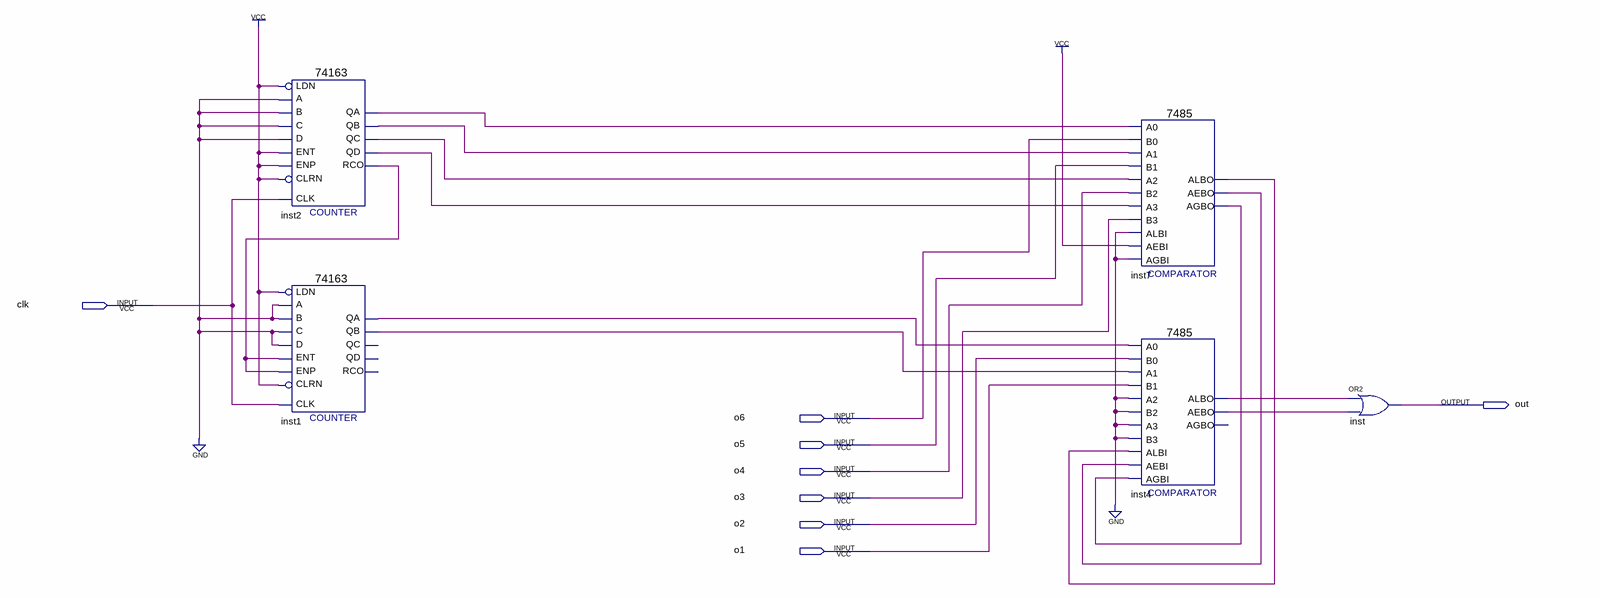
[diagram p0: schematic sheet]
// Quartus schematic Lab7part3.bdf as structural Verilog: 5 symbols, 8 pins
module Lab7part3 (
  input  clk,
  input  o6,
  input  o5,
  input  o4,
  input  o3,
  input  o2,
  input  o1,
  output out
);

  wire inst1_qa, inst1_qb, inst2_qa, inst2_qb, inst2_qc, inst2_qd, inst2_rco, inst4_aebo, inst4_albo,
       inst7_aebo, inst7_agbo, inst7_albo;

  \74163  inst2 (
    .C(1'b0), .B(1'b0), .A(1'b0), .ENT(1'b1), .D(1'b0), .CLRN(1'b1), .CLK(clk), .ENP(1'b1), .LDN(1'b1),
    .QA(inst2_qa), .QB(inst2_qb), .QC(inst2_qc), .QD(inst2_qd), .RCO(inst2_rco));
  \74163  inst1 (
    .C(1'b0), .B(1'b0), .A(1'b0), .ENT(inst2_rco), .D(1'b0), .CLRN(1'b1), .CLK(clk), .ENP(inst2_rco),
    .LDN(1'b1), .QA(inst1_qa), .QB(inst1_qb));  // open: QC, QD, RCO
  \7485  inst7 (
    .A3(inst2_qd), .B2(o4), .A2(inst2_qc), .AEBI(1'b1), .AGBI(1'b0), .ALBI(1'b0), .A0(inst2_qa), .B0(o6),
    .B3(o3), .A1(inst2_qb), .B1(o5), .ALBO(inst7_albo), .AGBO(inst7_agbo), .AEBO(inst7_aebo));
  \7485  inst4 (
    .A3(1'b0), .B2(1'b0), .A2(1'b0), .AEBI(inst7_aebo), .AGBI(inst7_agbo), .ALBI(inst7_albo), .A0(inst1_qa),
    .B0(o2), .B3(1'b0), .A1(inst1_qb), .B1(o1), .ALBO(inst4_albo), .AEBO(inst4_aebo));  // open: AGBO
  or inst (out, inst4_albo, inst4_aebo);
endmodule
